# Altium project SmartWatch.PrjPcb (part 2 of 3)

## Sheet [2] MCU.SchDoc: BLE SoC
size A4; ApprovedBy: Muhammet YILDIZ; CheckedBy: Muhammet YILDIZ; Author: Muhammet YILDIZ; CompanyName: YıLDıZ IoT; DrawnBy: Muhammet YILDIZ; Engineer: Muhammet YILDIZ; Organization: YıLDıZ IoT; Address1: Elperek Mahallesi; Address2: Saray Sokak No:12; Address3: SAKARYA / TURKEY; Revision: 1; SheetNumber: 2; SheetTotal: 7; SheetSize: A4
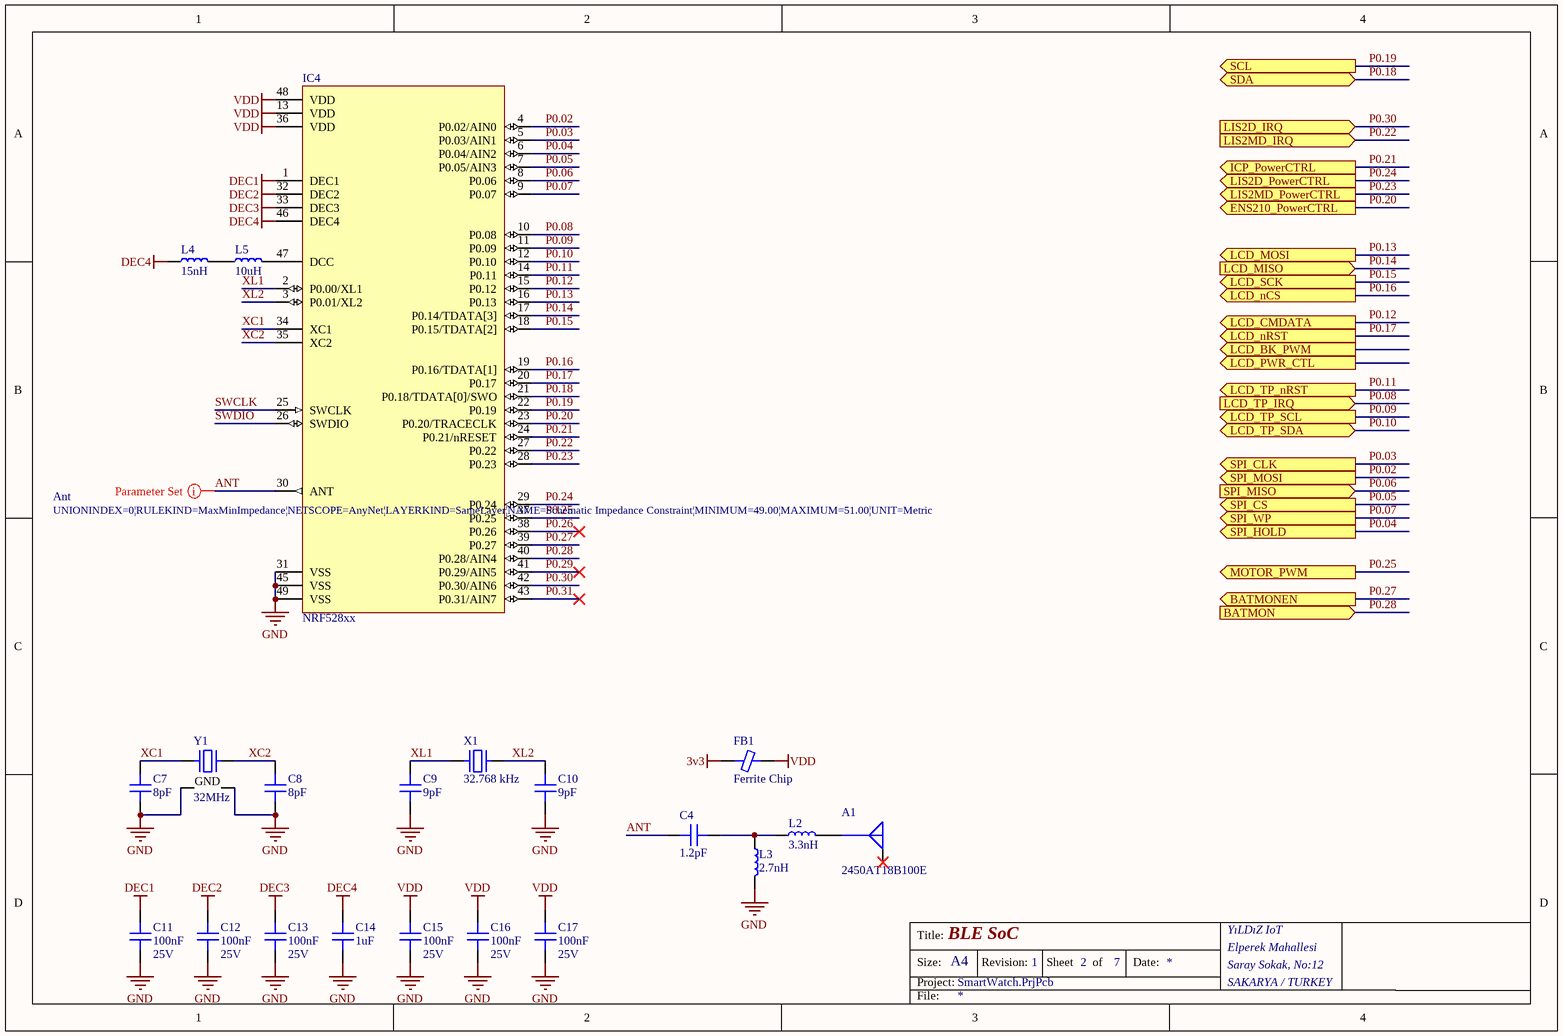
[diagram p2: [2] MCU.SchDoc]

### Parts
A1  2450AT18B100E  [ANTC3216X140N]
C4  1.2pF  [CAP 0402/1005]
C7  8pF  [CAP 0402/1005]
C8  8pF  [CAP 0402/1005]
C9  9pF  [CAP 0402/1005]
C10  9pF  [CAP 0402/1005]
C11  100nF  Voltage Rating (DC): 25V  [CAP 0402/1005]
C12  100nF  Voltage Rating (DC): 25V  [CAP 0402/1005]
C13  100nF  Voltage Rating (DC): 25V  [CAP 0402/1005]
C14  1uF  [CAP 0402/1005]
C15  100nF  Voltage Rating (DC): 25V  [CAP 0402/1005]
C16  100nF  Voltage Rating (DC): 25V  [CAP 0402/1005]
C17  100nF  Voltage Rating (DC): 25V  [CAP 0402/1005]
FB1  Ferrite Chip  [FER 0402/1005]  (no BOM)
IC4  NRF528xx  [QFN40P600X600X90-48N]
L2  3.3nH  [IND 0402/1005 RF WW]
L3  2.7nH  [IND 0402/1005 RF WW]
L4  15nH  [IND 0402/1005 RF WW]
L5  10uH  [IND 0603/1608 RF]
X1  32.768 kHz  [ABRACON ABS06]
Y1  32MHz  [KYOCERA CX2016DB]

### Ports
BATMON (in), BATMONEN (out), ENS210_PowerCTRL (out), ICP_PowerCTRL (out), LCD_BK_PWM (out), LCD_CMDATA (out), LCD_MISO (in), LCD_MOSI (out), LCD_nCS (out), LCD_nRST (out), LCD_PWR_CTL (out), LCD_SCK (out), LCD_TP_IRQ (in), LCD_TP_nRST (out), LCD_TP_SCL (out), LCD_TP_SDA (bidir), LIS2D_IRQ (in), LIS2D_PowerCTRL (out), LIS2MD_IRQ (in), LIS2MD_PowerCTRL (out), MOTOR_PWM (out), SCL (out), SDA (bidir), SPI_CLK (out), SPI_CS (out), SPI_HOLD (out), SPI_MISO (in), SPI_MOSI (out), SPI_WP (out)

### Nets
3v3: FB1.1
DEC1: C11.2 IC4.1(DEC1)
DEC2: C12.2 IC4.32(DEC2)
DEC3: C13.2 IC4.33(DEC3)
DEC4: C14.2 IC4.46(DEC4) L4.1
GND: C7.1 C8.1 C9.1 C10.1 C11.1 C12.1 C13.1 C14.1 C15.1 C16.1 C17.1 IC4.31(VSS) IC4.45(VSS) IC4.49(VSS) L3.2 Y1.2(GND) Y1.4(GND)
VDD: C15.2 C16.2 C17.2 FB1.2 IC4.13(VDD) IC4.36(VDD) IC4.48(VDD)
ANT: C4.2 IC4.30(ANT)
P0.02: IC4.4(P0.02/AIN0) ; port SPI_MOSI  [project net FLASH_MOSI]
P0.03: IC4.5(P0.03/AIN1) ; port SPI_CLK  [project net FLASH_CLK]
P0.04: IC4.6(P0.04/AIN2) ; port SPI_HOLD  [project net FLASH_HOLD]
P0.05: IC4.7(P0.05/AIN3) ; port SPI_CS  [project net FLASH_nCS]
P0.06: IC4.8(P0.06) ; port SPI_MISO  [project net FLASH_MISO]
P0.07: IC4.9(P0.07) ; port SPI_WP  [project net FLASH_WP]
P0.08: IC4.10(P0.08) ; port LCD_TP_IRQ  [project net LCD_TP_IRQ]
P0.09: IC4.11(P0.09) ; port LCD_TP_SCL  [project net LCD_TP_SCL]
P0.10: IC4.12(P0.10) ; port LCD_TP_SDA  [project net LCD_TP_SDA]
P0.11: IC4.14(P0.11) ; port LCD_TP_nRST  [project net LCD_TP_nRST]
P0.12: IC4.15(P0.12) ; port LCD_CMDATA  [project net CMD/DATA]
P0.13: IC4.16(P0.13) ; port LCD_MOSI  [project net LCD_MOSI]
P0.14: IC4.17(P0.14/TDATA[3]) ; port LCD_MISO  [project net LCD_MISO]
P0.15: IC4.18(P0.15/TDATA[2]) ; port LCD_SCK  [project net LCD_SCK]
P0.16: IC4.19(P0.16/TDATA[1]) ; port LCD_nCS  [project net LCD_nCS]
P0.17: IC4.20(P0.17) ; port LCD_nRST  [project net LCD_nRST]
P0.18: IC4.21(P0.18/TDATA[0]/SWO) ; port SDA
P0.19: IC4.22(P0.19) ; port SCL
P0.20: IC4.23(P0.20/TRACECLK) ; port ENS210_PowerCTRL  [project net ENS210_PowerCTRL]
P0.21: IC4.24(P0.21/nRESET) ; port ICP_PowerCTRL  [project net ICP_PowerCTRL]
P0.22: IC4.27(P0.22) ; port LIS2MD_IRQ  [project net LIS2MD_IRQ]
P0.23: IC4.28(P0.23) ; port LIS2MD_PowerCTRL  [project net LIS2MD_PowerCTRL]
P0.24: IC4.29(P0.24) ; port LIS2D_PowerCTRL  [project net LIS2D_PowerCTRL]
P0.25: IC4.37(P0.25) ; port MOTOR_PWM  [project net MOTOR_PWM]
P0.26: IC4.38(P0.26)
P0.27: IC4.39(P0.27) ; port BATMONEN  [project net BATMONEN]
P0.28: IC4.40(P0.28/AIN4) ; port BATMON  [project net BATMON]
P0.29: IC4.41(P0.29/AIN5)
P0.30: IC4.42(P0.30/AIN6) ; port LIS2D_IRQ  [project net LIS2D_IRQ]
P0.31: IC4.43(P0.31/AIN7)
SWCLK: IC4.25(SWCLK)
SWDIO: IC4.26(SWDIO)
XC1: C7.2 IC4.34(XC1) Y1.1
XC2: C8.2 IC4.35(XC2) Y1.3
XL1: C9.2 IC4.2(P0.00/XL1) X1.1
XL2: C10.2 IC4.3(P0.01/XL2) X1.2
NetA1_S: A1.S L2.2
NetC4_1: C4.1 L2.1 L3.1
NetIC4_47: IC4.47(DCC) L5.2
NetL4_2: L4.2 L5.1

Not connected (* = marked no-connect by the designer): A1 G*; IC4 44(NC)

### Layout directives
rule Impedance Constraint [Min = 49.00    Max = 51.00    ]; net class Ant: ANT

### Notes on the sheet
- Title:
- Size:
- Project:
- Revision:
- Sheet
- of
- Date:
- YıLDıZ IoT
- Elperek Mahallesi
- Saray Sokak, No:12
- SAKARYA / TURKEY
- File:

### Library data of the parts
A1 = Antenna: Antenna Chip -0.5dBi Gain 2500MHz 2-Pin CSMD T/R; Manufacturer: Johanson; Impedance: 50R; Bandwidth: 100MHz; Power Rating: 3W; Number of Bands: 1; Return Loss: -9.5dB; Frequency: 2.45GHz; Max Frequency: 2.5GHz; Gain: -0.5dB; Min Frequency: 2.4GHz; Supplier 1: Digi-Key; Supplier Part Number 1: 712-1006-1-ND; Manufacturer Part Number: 2450AT18B100E; RoHS: Yes; Category: RF Antennas; Stock 1: 432864; Pricing 1: 1=0,56000, 10=0,49500, 25=0,46480, 100=0,37950, 250=0,35248, 500=0,30000, 1000=0,24000 (USD); Mount: Surface Mount; Case/Package: CSMD; Contact Plating: Tin; Min Operating Temperature: -40°C; Max Operating Temperature: 85°C; Package Quantity: 1; Packaging: Tape and Reel; Max Power Dissipation: 3W; Termination: Solder; Series: -; Input Impedance: 50R; Input Power: 3W; Length: 3.2mm; Width: 1.6mm; Height: 0.051inch; Radiation Hardening: No; REACH SVHC: No SVHC; RoHS Compliant: Yes; ComponentLink1URL: https://datasheet.ciiva.com/24025/antenna-2450at18b100-242422-24025839.pdf?src-supplier=Mouser; ComponentLink1Description: https://datasheet.ciiva.com/24025/antenna-2450at18b100-242422-24025839.pdf?src-supplier=Mouser; ComponentLink2URL: https://datasheet.ciiva.com/1124/1318299-1124918.pdf?src-supplier=Element14; ComponentLink2Description: https://datasheet.ciiva.com/1124/1318299-1124918.pdf?src-supplier=Element14
C4 = Capacitor - Ceramic: Cap Ceramic 1.2pF 50V C0G 0.1pF SMD 0402 125C Paper T/R; Manufacturer: Johanson; Manufacturer Part Number: 500R07S1R2BV4T; Supplier 1: Digi-Key; Supplier Part Number 1: 712-1268-1-ND; RoHS: Yes; Category: Ceramic Capacitors; Stock 1: 1153; Pricing 1: 1=0,19000, 10=0,13000, 50=0,07820, 100=0,06600, 500=0,04518, 1000=0,03997, 2500=0,03824, 5000=0,03476 (USD); Case/Package: 0402; Number of Pins: 2; Dielectric Material: Ceramic; Contact Plating: Tin,Matte; Case Code (Imperial): 0402; Case Code (Metric): 1005; Min Operating Temperature: -55°C; Max Operating Temperature: 125°C; Packaging: Tape and Reel; Capacitance: 1.2pF; Dielectric: C0G; Voltage Rating (DC): 50V; Voltage Rating: 50V; Termination: SMD/SMT; Package Quantity: 10000; Series: S; Construction: Flat; Length: 1.02mm; Width: 0.02inch; Height: 0.64mm; Depth: 0.51mm; Thickness: 0.024inch; Radiation Hardening: No; REACH SVHC: Unknown; RoHS Compliant: Yes; ComponentLink1URL: https://datasheet.ciiva.com/1461/1731432-1461669.pdf?src-supplier=Element14; ComponentLink1Description: https://datasheet.ciiva.com/1461/1731432-1461669.pdf?src-supplier=Element14; ComponentLink2URL: https://datasheet.ciiva.com/22697/1731432-22697547.pdf?src-supplier=Element14; ComponentLink2Description: https://datasheet.ciiva.com/22697/1731432-22697547.pdf?src-supplier=Element14; ComponentLink3URL: https://datasheet.ciiva.com/28495/1932950-28495023.pdf?src-supplier=Element14; ComponentLink3Description: https://datasheet.ciiva.com/28495/1932950-28495023.pdf?src-supplier=Element14
C7 C8 = Capacitor - Ceramic: 0402 8 pF 50 V ±0.25 pF Tolerance C0G/NP0 Multilayer Ceramic Capacitor; Manufacturer: Murata; Manufacturer Part Number: GJM1555C1H8R0CB01D; Voltage Rating: 50V; Dielectric: C0G; Supplier 1: Digi-Key; Supplier Part Number 1: 490-3109-1-ND; RoHS: Yes; Category: Ceramic Capacitors; Stock 1: 170937; Pricing 1: 1=0,12000, 10=0,08500, 50=0,04620, 100=0,03770, 500=0,02696, 1000=0,02118, 2500=0,01925, 5000=0,01771 (USD); Mount: Surface Mount; Case/Package: 0402; Case Code (Metric): 1005; Case Code (Imperial): 0402; Min Operating Temperature: -55°C; Max Operating Temperature: 125°C; Capacitance: 8pF; Packaging: Tape and Reel; Package Quantity: 1; Voltage Rating (DC): 50V; Termination: SMD/SMT; Series: GJM; Construction: Flat; Length: 1mm; Width: 0.02inch; Height: 0.5mm; Thickness: 0.022inch; Depth: 0.5mm; Radiation Hardening: No; Lead Free: Lead Free; RoHS Compliant: Yes; ComponentLink1URL: https://datasheet.ciiva.com/2989/product-2989255.pdf?src-supplier=Avnet; ComponentLink1Description: https://datasheet.ciiva.com/2989/product-2989255.pdf?src-supplier=Avnet; ComponentLink2URL: https://datasheet.ciiva.com/165/partnumbering-e-01-165050.pdf?src-supplier=Digi-Key; ComponentLink2Description: https://datasheet.ciiva.com/165/partnumbering-e-01-165050.pdf?src-supplier=Digi-Key; ComponentLink3URL: https://datasheet.ciiva.com/29534/partnumbering-e-01-29534170.pdf?src-supplier=Digi-Key; ComponentLink3Description: https://datasheet.ciiva.com/29534/partnumbering-e-01-29534170.pdf?src-supplier=Digi-Key; ComponentLink4URL: https://datasheet.ciiva.com/29534/partnumbering-e-01-29534171.pdf?src-supplier=Digi-Key; ComponentLink4Description: https://datasheet.ciiva.com/29534/partnumbering-e-01-29534171.pdf?src-supplier=Digi-Key
C9 C10 = Capacitor - Ceramic: Cap Ceramic 9pF 50V C0G 0.25pF SMD 0402 125°C Paper T/R; Manufacturer: Samsung; Manufacturer Part Number: CL05C090CB5NNNC; Supplier 1: Digi-Key; Supplier Part Number 1: 1276-1616-1-ND; RoHS: Yes; Category: Ceramic Capacitors; Stock 1: 152596; Pricing 1: 1=0,10000, 10=0,04800, 50=0,02620, 100=0,02140, 500=0,01528, 1000=0,01201, 2500=0,01092, 5000=0,01004 (USD); Mount: Surface Mount; Case/Package: 0402; Case Code (Metric): 1005; Case Code (Imperial): 0402; Min Operating Temperature: -55°C; Max Operating Temperature: 125°C; Packaging: Tape and Reel; Package Quantity: 1; Capacitance: 9pF; Voltage Rating: 50V; Dielectric: C0G; Voltage Rating (DC): 50V; Series: CL; Construction: Flat; Length: 1mm; Width: 0.02inch; Height: 0.5mm; Thickness: 0.022inch; Depth: 0.5mm; Radiation Hardening: No; RoHS Compliant: Yes; ComponentLink1URL: https://datasheet.ciiva.com/25803/cl05c090cb5nnnc-25803844.pdf?src-supplier=Digi-Key; ComponentLink1Description: https://datasheet.ciiva.com/25803/cl05c090cb5nnnc-25803844.pdf?src-supplier=Digi-Key
C11-C13 C15-C17 = Capacitor - Ceramic: Cap Ceramic 0.1uF 25V X5R 10% Pad SMD 0402 85¡ãC T/R / Multi Layer Ceramic Capacitor (MLCC); Manufacturer: Samsung; Manufacturer Part Number: CL05A104KA5NNNC; Supplier 1: Digi-Key; Supplier Part Number 1: 1276-1043-6-ND; RoHS: Yes; Category: Ceramic Capacitors; Pricing 1: 1=0,10000, 10=0,01100, 50=0,00600, 100=0,00490, 500=0,00346, 1000=0,00272, 2500=0,00248, 5000=0,00228 (USD); Mount: Surface Mount; Case/Package: 0402; Case Code (Imperial): 0402; Case Code (Metric): 1005; Min Operating Temperature: -55°C; Max Operating Temperature: 85°C; Capacitance: 100nF; Packaging: Tape and Reel; Tolerance: 10%; Package Quantity: 1; Voltage Rating: 25V; Dielectric: X5R; Voltage: 25V; Length: 1mm; Width: 0.02inch; Height: 0.5mm; Thickness: 0.022inch; Depth: 0.5mm; Radiation Hardening: No; Lead Free: Lead Free; ComponentLink1URL: https://datasheet.ciiva.com/25802/cl05a104ka5nnnc-25802704.pdf?src-supplier=Digi-Key; ComponentLink1Description: https://datasheet.ciiva.com/25802/cl05a104ka5nnnc-25802704.pdf?src-supplier=Digi-Key; ComponentLink2URL: https://datasheet.ciiva.com/16437/cl05a104ka5nnnc-16437369.pdf?src-supplier=Future+Electronics; ComponentLink2Description: https://datasheet.ciiva.com/16437/cl05a104ka5nnnc-16437369.pdf?src-supplier=Future+Electronics; ComponentLink3URL: https://datasheet.ciiva.com/26838/getdatasheetpartid-357412-26838142.pdf?src-supplier=Verical; ComponentLink3Description: https://datasheet.ciiva.com/26838/getdatasheetpartid-357412-26838142.pdf?src-supplier=Verical; ComponentLink4URL: https://datasheet.ciiva.com/26309/mlcc-catalogdownload2013-eng-26309014.pdf?src-supplier=Distrelec; ComponentLink4Description: https://datasheet.ciiva.com/26309/mlcc-catalogdownload2013-eng-26309014.pdf?src-supplier=Distrelec
C14 = Capacitor - Ceramic: Ceramic capacitor SMD-0402 1000nF /16V X5R# K +-10%, Samsung, RoHS; Manufacturer Part Number: CL05A105KO5NNNC; Tolerance: 10%; Voltage Rating: 16V; Dielectric: X5R; Supplier 1: Digi-Key; Supplier Part Number 1: 1276-1067-1-ND; Manufacturer: Samsung; RoHS: Yes; Category: Ceramic Capacitors; Stock 1: 5192112; Pricing 1: 1=0,10000, 10=0,04400, 50=0,02400, 100=0,01960, 500=0,01402, 1000=0,01101, 2500=0,01001, 5000=0,00921 (USD); Mount: Surface Mount; Case/Package: 0402; Contact Plating: Tin; Case Code (Metric): 1005; Case Code (Imperial): 0402; Min Operating Temperature: -55°C; Max Operating Temperature: 85°C; Packaging: Tape and Reel; Package Quantity: 1; Series: CL; Capacitance: 1uF; Voltage: 16V; Construction: Flat; Length: 1mm; Width: 0.02inch; Height: 0.5mm; Thickness: 0.022inch; Depth: 0.5mm; Radiation Hardening: No; RoHS Compliant: Yes; ComponentLink1URL: https://datasheet.ciiva.com/16207/cl05a105ko5nnnc-16207571.pdf?src-supplier=Future+Electronics; ComponentLink1Description: https://datasheet.ciiva.com/16207/cl05a105ko5nnnc-16207571.pdf?src-supplier=Future+Electronics; ComponentLink2URL: https://datasheet.ciiva.com/15195/getdatasheetpartid-355272-15195629.pdf?src-supplier=Verical; ComponentLink2Description: https://datasheet.ciiva.com/15195/getdatasheetpartid-355272-15195629.pdf?src-supplier=Verical
FB1 = Ferrite Chip: SMT Ferrite Chip
IC4 = NRF528xx: Manufacturer: Nordic Semiconductor ASA; Manufacturer Part Number: NRF52832-QFAB-R; Satıcı: Digikey; RF Family/Standard: Bluetooth, General ISM > 1GHz; Frequency: 2.4GHz; Sensitivity: -96dBm; Power Output: 4dBm; Data Rate: 2Mbps; Current Receiving: 6,5mA; Voltage Supply: 1.7 - 3.6 V; Memory Size: 256kB Flash, 32kB RAM; Current Transmitting: 7,1mA; Protocol: ANT, Bluetooth v4.0; Serial Interfaces: I²C, SPI, UART; GPIO: 32; Depo Kodu: *; Package / Case: 48-VFQFN Exposed Pad; Satın Alma Linki: *; Datasheet: http://infocenter.nordicsemi.com/pdf/nRF52832_PS_v1.4.pdf; Suplier Code: *; Modulation: -; Operating Temperature: -40°C ~ 85°C; Mounting Type: Surface Mount; Type: TxRx + MCU; Value: NRF528xx
L2 = Inductor Air Core: Inductor RF Chip Multi-Layer 0.0033uH 0.3nH 100MHz 8Q-Factor Ceramic 0.3A 0.19Ohm DCR 0402 T/R; Manufacturer: Johanson; Manufacturer Part Number: L-07C3N3SV6T; Current Rating: 300mA; Shielding: Unshielded; Q Factor: 8; DC Resistance (DCR): 190mR; Self Resonant Frequency: 21GHz; Supplier 1: Digi-Key; Supplier Part Number 1: 712-1416-1-ND; RoHS: Yes; Category: Fixed Inductors; Stock 1: 842404; Pricing 1: 1=0,10000, 10=0,05000, 25=0,04480, 50=0,04000, 100=0,03390, 250=0,02992, 500=0,02744, 1000=0,02344, 2500=0,02095 (USD); Mount: Surface Mount; Case/Package: 0402; Number of Pins: 2; Case Code (Metric): 1005; Case Code (Imperial): 0402; Core Material: Ceramic; Weight: 2.3E-05oz; Min Operating Temperature: -40°C; Max Operating Temperature: 100°C; Packaging: Cut Tape; Package Quantity: 10000; Inductance: 3.3nH; Test Frequency: 100MHz; Max DC Current: 300mA; Termination: SMD/SMT; DC Current: 300mA; Series: L-07; Length: 1mm; Width: 0.5mm; Height: 0.5mm; Height - Seated (Max): 0.024inch; Depth: 0.6mm; Radiation Hardening: No; REACH SVHC: No SVHC; Military Standard: Not; RoHS Compliant: Yes; ComponentLink1URL: https://datasheet.ciiva.com/1473/1168792-1473902.pdf?src-supplier=Element14; ComponentLink1Description: https://datasheet.ciiva.com/1473/1168792-1473902.pdf?src-supplier=Element14
L3 = Inductor Air Core: Inductor RF Chip Multi-Layer 0.0027uH 0.3nH 100MHz 8Q-Factor Ceramic 0.3A 0.17Ohm DCR 0402 T/R; Manufacturer: Johanson; Manufacturer Part Number: L-07C2N7SV6T; Q Factor: 8; Current Rating: 300mA; Shielding: Unshielded; DC Resistance (DCR): 170mR; Self Resonant Frequency: 9.5GHz; Supplier 1: Digi-Key; Supplier Part Number 1: 712-1415-1-ND; RoHS: Yes; Category: Fixed Inductors; Stock 1: 895162; Pricing 1: 1=0,10000, 10=0,05000, 25=0,04480, 50=0,04000, 100=0,03390, 250=0,02992, 500=0,02744, 1000=0,02344, 2500=0,02095 (USD); Mount: Surface Mount; Case/Package: 0402; Number of Pins: 2; Case Code (Metric): 1005; Case Code (Imperial): 0402; Weight: 2.3E-05oz; Core Material: Ceramic; Contact Plating: Tin,Matte; Min Operating Temperature: -40°C; Max Operating Temperature: 100°C; Packaging: Tape and Reel; Package Quantity: 1; Inductance: 2.7nH; Test Frequency: 100MHz; Max DC Current: 300mA; Termination: SMD/SMT; DC Current: 300mA; Series: -; Length: 1mm; Width: 0.02inch; Height: 0.5mm; Height - Seated (Max): 0.024inch; Depth: 0.6mm; Radiation Hardening: No; REACH SVHC: No SVHC; Military Standard: Not; RoHS Compliant: Yes; ComponentLink1URL: https://datasheet.ciiva.com/1473/1168792-1473898.pdf?src-supplier=Element14; ComponentLink1Description: https://datasheet.ciiva.com/1473/1168792-1473898.pdf?src-supplier=Element14
L4 = Inductor Air Core: Ind High Frequency Chip Multi-Layer 15nH 5% 100MHz 8Q-Factor Ceramic 320mA 0402 T/R; Manufacturer: Taiyo Yuden; Manufacturer Part Number: HK100515NJ-T; Core Material: Ferrite,Ceramic; Shielding: Unshielded; Self Resonant Frequency: 2.3GHz; Q Factor: 8; DC Resistance (DCR): 460mR; Max DC Current: 300mA; Supplier 1: Avnet; Supplier Part Number 1: HK100515NJ-T; RoHS: Yes; Category: Fixed Inductors; Mount: Surface Mount; Case/Package: 0402; Number of Pins: 2; Case Code (Metric): 1005; Case Code (Imperial): 0402; Body Material: Ceramic; Min Operating Temperature: -55°C; Max Operating Temperature: 125°C; Packaging: Tape and Reel; Inductance: 15nH; Current Rating: 320mA; Package Quantity: 10000; Test Frequency: 100MHz; Termination: SMD/SMT; Tolerance: 5%; Series: HK; Inductance Tolerance: 5%; DC Current: 320mA; Length: 0.039inch; Width: 0.02inch; Height: 0.5mm; Height - Seated (Max): 0.022inch; Depth: 0.55mm; Radiation Hardening: No; RoHS Compliant: Yes; Lead Free: Exempt; Halogen Free: Halogen Free; REACH SVHC: Unknown; Military Standard: Not; ComponentLink1URL: https://datasheet.ciiva.com/6688/hk100515nj-t-ss-6688640.pdf?src-supplier=Digi-Key; ComponentLink1Description: https://datasheet.ciiva.com/6688/hk100515nj-t-ss-6688640.pdf?src-supplier=Digi-Key; ComponentLink2URL: https://datasheet.ciiva.com/8498/hk100515nj-t-ss-8498917.pdf?src-supplier=Avnet; ComponentLink2Description: https://datasheet.ciiva.com/8498/hk100515nj-t-ss-8498917.pdf?src-supplier=Avnet; ComponentLink3URL: https://datasheet.ciiva.com/26871/getdatasheetpartid-645793-26871605.pdf?src-supplier=Verical; ComponentLink3Description: https://datasheet.ciiva.com/26871/getdatasheetpartid-645793-26871605.pdf?src-supplier=Verical; ComponentLink4URL: https://datasheet.ciiva.com/15986/1443hk100515nj-t-15986294.pdf?src-supplier=Onlinecomponents.com; ComponentLink4Description: https://datasheet.ciiva.com/15986/1443hk100515nj-t-15986294.pdf?src-supplier=Onlinecomponents.com; ComponentLink5URL: https://datasheet.ciiva.com/30215/1387hk100515nj-t-30215366.pdf?src-supplier=Onlinecomponents.com; ComponentLink5Description: https://datasheet.ciiva.com/30215/1387hk100515nj-t-30215366.pdf?src-supplier=Onlinecomponents.com
L5 = Inductor Air Core: Inductor Chip Wirewound 10uH 10% 2.52MHz Ferrite 80mA 468mOhm DCR 0603 T/R; Manufacturer: Taiyo Yuden; Manufacturer Part Number: LBMF1608T100K; Self Resonant Frequency: 32MHz; Shielding: Unshielded; DC Resistance (DCR): 360mR; Supplier 1: Digi-Key; Supplier Part Number 1: 587-1714-1-ND; RoHS: Yes; Category: Fixed Inductors; Stock 1: 1662; Pricing 1: 1=0,25000, 10=0,22300, 25=0,19800, 50=0,16840, 100=0,14850, 250=0,13612, 500=0,12376, 1000=0,10395 (USD); Mount: Surface Mount; Case/Package: 0603; Core Material: Ferrite; Case Code (Metric): 1608; Case Code (Imperial): 0603; Weight: 7.1E-05oz; Min Operating Temperature: -40°C; Max Operating Temperature: 105°C; Packaging: Tape and Reel; Inductance: 10uH; Inductance Tolerance: 10%; Package Quantity: 3000; Tolerance: 10%; Current Rating: 80mA; Resistor Type: Wirewound; Test Frequency: 2.52MHz; Max DC Current: 80mA; Termination: SMD/SMT; DC Current: 80mA; Series: LB; Length: 0.063inch; Width: 0.031inch; Height: 0.35mm; Height - Seated (Max): 0.039inch; Lead Pitch: 0.7mm; Depth: 0.9mm; Radiation Hardening: No; Lead Free: Lead Free; Halogen Free: Halogen Free; REACH SVHC: Unknown; Military Standard: Not; RoHS Compliant: Yes; ComponentLink1URL: https://datasheet.ciiva.com/8504/lbmf1608t100k-ss-8504740.pdf?src-supplier=Avnet; ComponentLink1Description: https://datasheet.ciiva.com/8504/lbmf1608t100k-ss-8504740.pdf?src-supplier=Avnet; ComponentLink2URL: https://datasheet.ciiva.com/26872/getdatasheetpartid-637440-26872437.pdf?src-supplier=Verical; ComponentLink2Description: https://datasheet.ciiva.com/26872/getdatasheetpartid-637440-26872437.pdf?src-supplier=Verical; ComponentLink3URL: https://datasheet.ciiva.com/1040/lbmf1608t100k-ss-1040360.pdf?src-supplier=Digi-Key; ComponentLink3Description: https://datasheet.ciiva.com/1040/lbmf1608t100k-ss-1040360.pdf?src-supplier=Digi-Key; ComponentLink4URL: https://datasheet.ciiva.com/15986/610lbmf1608t100k-15986589.pdf?src-supplier=Onlinecomponents.com; ComponentLink4Description: https://datasheet.ciiva.com/15986/610lbmf1608t100k-15986589.pdf?src-supplier=Onlinecomponents.com; ComponentLink5URL: https://datasheet.ciiva.com/46395/1497259-46395174.pdf?src-supplier=Element14; ComponentLink5Description: https://datasheet.ciiva.com/46395/1497259-46395174.pdf?src-supplier=Element14
X1 = Abracon Crystal ABS06: Crystal 32.7680KHZ 9PF SMD; Manufacturer: Micro Crystal; Manufacturer Part Number: CM8V-T1A-32.768KHZ-9PF-20PPM-TA-QC; Supplier 1: Digi-Key; Supplier Part Number 1: 2195-CM8V-T1A-32.768KHZ-9PF-20PPM-TA-QCDKR-ND; RoHS: No; Stock 1: 55147; Pricing 1: 1=0,66000, 10=0,54700, 50=0,49260, 100=0,43780, 500=0,41592 (USD); Frequency: 32.768 kHz
Y1 = CX2016DB32000D0WZRC1: CRYSTAL 32.0000MHZ 8PF SMD; Manufacturer: Kyocera International Inc. Electronic Components; ESR (Equivalent Series Resistance): 60 Ohms; Frequency Stability: ±40ppm; Frequency Tolerance: ±25ppm; Operating Mode: Fundamental; Part Number: CX2016DB32000D0WZRC1; ComponentLink1Description: Datasheet; ComponentLink1URL: https://global.kyocera.com/prdct/electro/product/pdf/cx2016db_e.pdf; ComponentLink2Description: DigiKey Link; ComponentLink2URL: http://digikey.com/product-detail/en/kyocera-international-inc-electronic-components/CX2016DB32000D0WZRC1/1253-1586-1-ND/5436848; Frequency: 32MHz; Height - Seated (Max): 0.018" (0.45mm); LastUpdated: 02.09.2020 01:21:56; Lifecycle Status: Active; Load Capacitance: 8pF; Minimum Order: 1; Mounting Type: Surface Mount; Operating Temperature: -25°C ~ 75°C; Package / Case: 4-SMD, No Lead; Packaging: TapeAndReel; PartId: 466; Part Status: Active; Price: 0.36; Series: CX2016DB, Kyocera; Size / Dimension: 0.079" L x 0.063" W (2.00mm x 1.60mm); Supplier 1: DigiKey; Supplier Part Number 1: 1253-1586-1-ND; Type: MHz Crystal; Value: 32MHz

## Sheet [3] Sensor.SchDoc: Sensors
size A4; ApprovedBy: Muhammet YILDIZ; CheckedBy: Muhammet YILDIZ; Author: Muhammet YILDIZ; CompanyName: YıLDıZ IoT; DrawnBy: Muhammet YILDIZ; Engineer: Muhammet YILDIZ; Organization: YıLDıZ IoT; Address1: Elperek Mahallesi; Address2: Saray Sokak No:12; Address3: SAKARYA / TURKEY; Revision: 1; SheetNumber: 3; SheetTotal: 7; SheetSize: A4
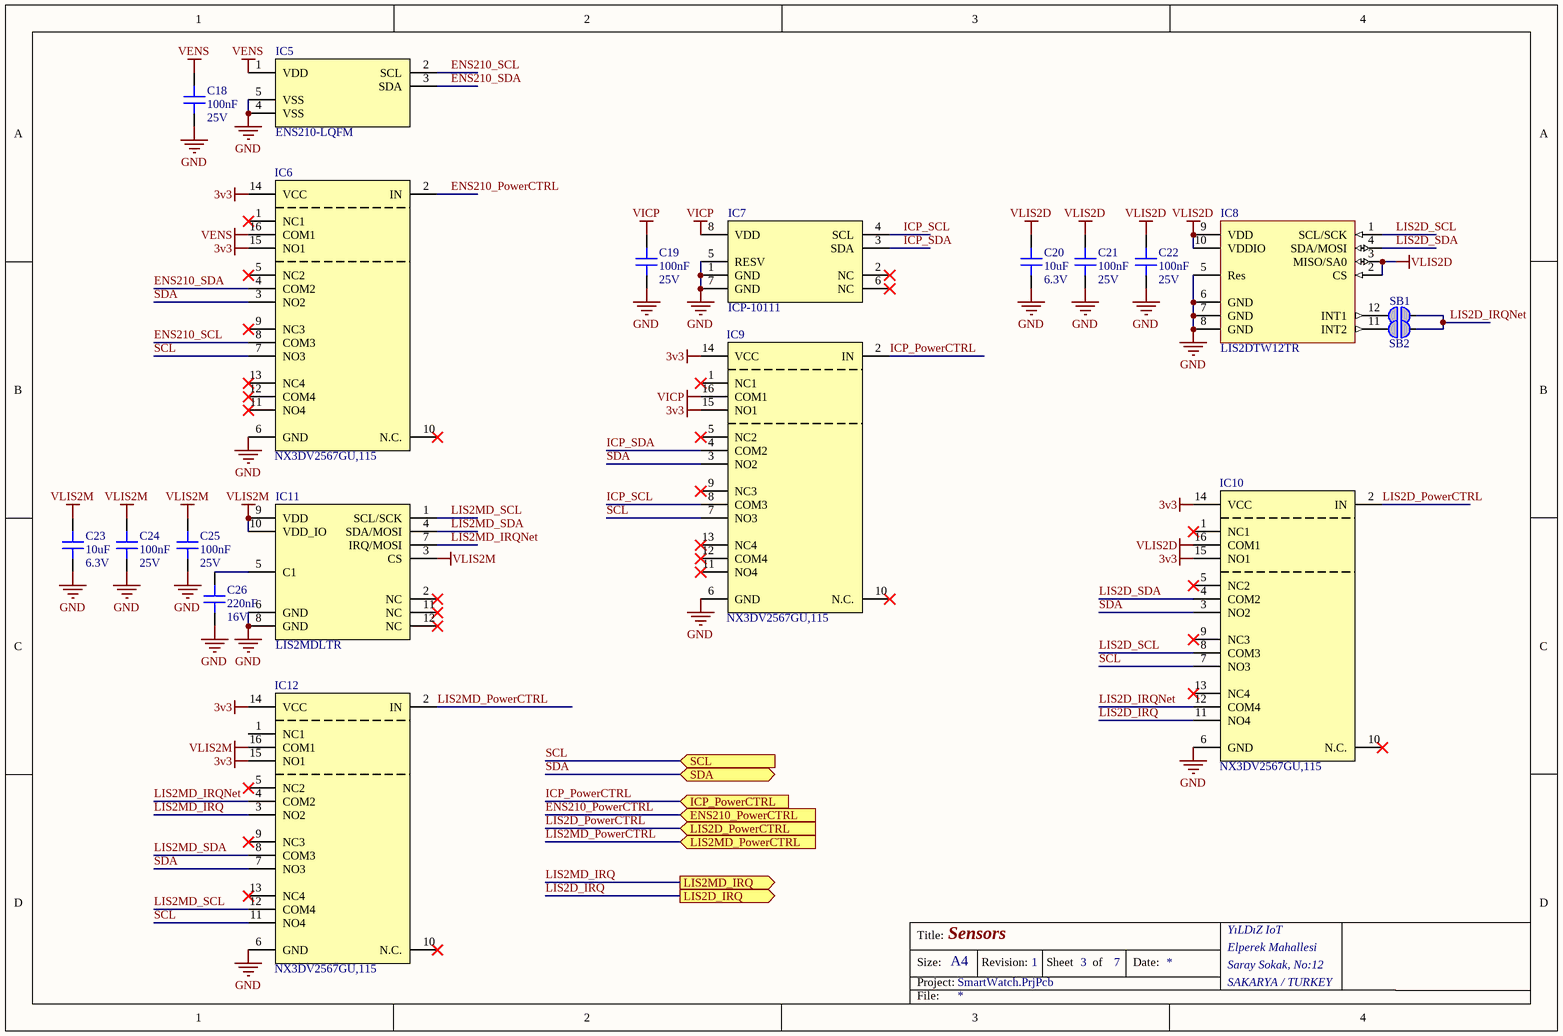
[diagram p3: [3] Sensor.SchDoc]

### Parts
C18  100nF  Voltage Rating (DC): 25V  [CAP 0402/1005]
C19  100nF  Voltage Rating (DC): 25V  [CAP 0402/1005]
C20  10uF  Voltage Rating: 6.3V  [CAP 0402/1005]
C21  100nF  Voltage Rating (DC): 25V  [CAP 0402/1005]
C22  100nF  Voltage Rating (DC): 25V  [CAP 0402/1005]
C23  10uF  Voltage Rating: 6.3V  [CAP 0402/1005]
C24  100nF  Voltage Rating (DC): 25V  [CAP 0402/1005]
C25  100nF  Voltage Rating (DC): 25V  [CAP 0402/1005]
C26  220nF  Voltage Rating: 16V  [CAP 0402/1005]
IC5  ENS210-LQFM  [SCIONSENSE ENS210LQFM]
IC6  NX3DV2567GU,115  [NXP XQFN16]
IC7  ICP-10111  [TDK ICP10111]
IC8  LIS2DTW12TR  [ST LGA-12 2x2x0.7]
IC9  NX3DV2567GU,115  [NXP XQFN16]
IC10  NX3DV2567GU,115  [NXP XQFN16]
IC11  LIS2MDLTR  [ST LGA-12 2x2x0.7]
IC12  NX3DV2567GU,115  [NXP XQFN16]
SB1  (no value)  [Solderbridge-Circular]  (no BOM)
SB2  (no value)  [Solderbridge-Circular]  (no BOM)

### Ports
ENS210_PowerCTRL (in), ICP_PowerCTRL (in), LIS2D_IRQ (out), LIS2D_PowerCTRL (in), LIS2MD_IRQ (out), LIS2MD_PowerCTRL (in), SCL (in), SDA (bidir)

### Nets
3v3: IC6.14(VCC) IC6.15(NO1) IC9.14(VCC) IC9.15(NO1) IC10.14(VCC) IC10.15(NO1) IC12.14(VCC) IC12.15(NO1)
GND: C18.1 C19.1 C20.1 C21.1 C22.1 C23.1 C24.1 C25.1 C26.1 IC5.4(VSS) IC5.5(VSS) IC6.6(GND) IC7.1(GND) IC7.5(RESV) IC7.7(GND) IC8.5(Res) IC8.6(GND) IC8.7(GND) IC8.8(GND) IC9.6(GND) IC10.6(GND) IC11.6(GND) IC11.8(GND) IC12.6(GND)
VENS: C18.2 IC5.1(VDD) IC6.16(COM1)
VICP: C19.2 IC7.8(VDD) IC9.16(COM1)
VLIS2D: C20.2 C21.2 C22.2 IC8.2(CS) IC8.3(MISO/SA0) IC8.9(VDD) IC8.10(VDDIO) IC10.16(COM1)
VLIS2M: C23.2 C24.2 C25.2 IC11.3(CS) IC11.9(VDD) IC11.10(VDD_IO) IC12.16(COM1)
ENS210_PowerCTRL: IC6.2(IN) ; port ENS210_PowerCTRL
ENS210_SCL: IC5.2(SCL) IC6.8(COM3)
ENS210_SDA: IC5.3(SDA) IC6.4(COM2)
ICP_PowerCTRL: IC9.2(IN) ; port ICP_PowerCTRL
ICP_SCL: IC7.4(SCL) IC9.8(COM3)
ICP_SDA: IC7.3(SDA) IC9.4(COM2)
LIS2D_IRQ: IC10.11(NO4) ; port LIS2D_IRQ
LIS2D_IRQNet: IC10.12(COM4) SB1.2 SB2.2
LIS2D_PowerCTRL: IC10.2(IN) ; port LIS2D_PowerCTRL
LIS2D_SCL: IC8.1(SCL/SCK) IC10.8(COM3)
LIS2D_SDA: IC8.4(SDA/MOSI) IC10.4(COM2)
LIS2MD_IRQ: IC12.3(NO2) ; port LIS2MD_IRQ
LIS2MD_IRQNet: IC11.7(IRQ/MOSI) IC12.4(COM2)
LIS2MD_PowerCTRL: IC12.2(IN) ; port LIS2MD_PowerCTRL
LIS2MD_SCL: IC11.1(SCL/SCK) IC12.12(COM4)
LIS2MD_SDA: IC11.4(SDA/MOSI) IC12.8(COM3)
SCL: IC6.7(NO3) IC9.7(NO3) IC10.7(NO3) IC12.11(NO4) ; port SCL  [project net P0.19]
SDA: IC6.3(NO2) IC9.3(NO2) IC10.3(NO2) IC12.7(NO3) ; port SDA  [project net P0.18]
NetC26_2: C26.2 IC11.5(C1)
NetIC8_11: IC8.11(INT2) SB2.1
NetIC8_12: IC8.12(INT1) SB1.1

Not connected (* = marked no-connect by the designer): IC6 1(NC1)* 5(NC2)* 9(NC3)* 10(N.C.)* 11(NO4)* 12(COM4)* 13(NC4)*; IC7 2(NC)* 6(NC)*; IC9 1(NC1)* 5(NC2)* 9(NC3)* 10(N.C.)* 11(NO4)* 12(COM4)* 13(NC4)*; IC10 1(NC1)* 5(NC2)* 9(NC3)* 10(N.C.)* 13(NC4)*; IC11 2(NC)* 11(NC)* 12(NC)*; IC12 1(NC1) 5(NC2)* 9(NC3)* 10(N.C.)* 13(NC4)*

### Notes on the sheet
- Title:
- Size:
- Project:
- Revision:
- Sheet
- of
- Date:
- YıLDıZ IoT
- Elperek Mahallesi
- Saray Sokak, No:12
- SAKARYA / TURKEY
- File:

### Library data of the parts
C18 C19 C21 C22 C24 C25 = Capacitor - Ceramic: as C11 on sheet [2] MCU; Supplier 1: Digi-Key; Supplier Part Number 1: 1276-1043-6-ND; RoHS: Yes; Category: Ceramic Capacitors; Pricing 1: 1=0,10000, 10=0,01100, 50=0,00600, 100=0,00490, 500=0,00346, 1000=0,00272, 2500=0,00248, 5000=0,00228 (USD); Mount: Surface Mount; Case/Package: 0402; Case Code (Imperial): 0402; Case Code (Metric): 1005; Min Operating Temperature: -55°C; Max Operating Temperature: 85°C; Capacitance: 100nF; Packaging: Tape and Reel; Tolerance: 10%; Package Quantity: 1; Voltage Rating: 25V; Dielectric: X5R; Voltage: 25V; Length: 1mm; Width: 0.02inch; Height: 0.5mm; Thickness: 0.022inch; Depth: 0.5mm; Radiation Hardening: No; Lead Free: Lead Free; ComponentLink1URL: https://datasheet.ciiva.com/25802/cl05a104ka5nnnc-25802704.pdf?src-supplier=Digi-Key; ComponentLink1Description: https://datasheet.ciiva.com/25802/cl05a104ka5nnnc-25802704.pdf?src-supplier=Digi-Key; ComponentLink2URL: https://datasheet.ciiva.com/16437/cl05a104ka5nnnc-16437369.pdf?src-supplier=Future+Electronics; ComponentLink2Description: https://datasheet.ciiva.com/16437/cl05a104ka5nnnc-16437369.pdf?src-supplier=Future+Electronics; ComponentLink3URL: https://datasheet.ciiva.com/26838/getdatasheetpartid-357412-26838142.pdf?src-supplier=Verical; ComponentLink3Description: https://datasheet.ciiva.com/26838/getdatasheetpartid-357412-26838142.pdf?src-supplier=Verical; ComponentLink4URL: https://datasheet.ciiva.com/26309/mlcc-catalogdownload2013-eng-26309014.pdf?src-supplier=Distrelec; ComponentLink4Description: https://datasheet.ciiva.com/26309/mlcc-catalogdownload2013-eng-26309014.pdf?src-supplier=Distrelec
C20 C23 = Capacitor - Ceramic: 0402 10 uF 6.3 V ±20 % Tolerance X5R Surface Mount Multilayer Ceramic Capacitor; Manufacturer: Murata; Manufacturer Part Number: GRM155R60J106ME15D; Tolerance: 20%; Supplier 1: Digi-Key; Supplier Part Number 1: 490-13238-1-ND; RoHS: Yes; Category: Ceramic Capacitors; Pricing 1: 1=0,18000, 10=0,12400, 50=0,07440, 100=0,06280, 500=0,04296, 1000=0,03800, 2500=0,03635, 5000=0,03304 (USD); Mount: Surface Mount; Case/Package: 0402; Case Code (Metric): 1005; Case Code (Imperial): 0402; Min Operating Temperature: -55°C; Max Operating Temperature: 85°C; Packaging: Tape and Reel; Capacitance: 10uF; Voltage Rating (DC): 6.3V; Dielectric: X5R; Length: 0.039inch; Width: 0.02inch; Thickness: 0.026inch; RoHS Compliant: Yes; ComponentLink1URL: https://www.murata.com/~/media/webrenewal/support/library/catalog/products/capacitor/mlcc/c02e.ashx?la=en-us&src-supplier=Digi-Key; ComponentLink1Description: https://www.murata.com/~/media/webrenewal/support/library/catalog/products/capacitor/mlcc/c02e.ashx?la=en-us&src-supplier=Digi-Key
C26 = Capacitor - Ceramic: Ceramic capacitor SMD-0402 220nF /16V X7R# K +-10%, Samsung, RoHS; Manufacturer Part Number: CL05B224KO5NNNC; Tolerance: 10%; Dielectric: X7R; Supplier 1: Digi-Key; Supplier Part Number 1: 1276-1176-1-ND; Manufacturer: Samsung; RoHS: Yes; Category: Ceramic Capacitors; Pricing 1: 1=0,10000, 10=0,03300, 50=0,01780, 100=0,01460, 500=0,01040, 1000=0,00817, 2500=0,00742, 5000=0,00683 (USD); Mount: Surface Mount; Case/Package: 0402; Case Code (Metric): 1005; Case Code (Imperial): 0402; Min Operating Temperature: -55°C; Max Operating Temperature: 125°C; Packaging: Tape and Reel; Capacitance: 220nF; Package Quantity: 1; Series: CL; Construction: Flat; Length: 1mm; Width: 0.02inch; Height: 0.5mm; Thickness: 0.022inch; Depth: 0.5mm; Radiation Hardening: No; RoHS Compliant: Yes; ComponentLink1URL: https://datasheet.ciiva.com/25800/cl05b224ko5nnnc-25800450.pdf?src-supplier=Digi-Key; ComponentLink1Description: https://datasheet.ciiva.com/25800/cl05b224ko5nnnc-25800450.pdf?src-supplier=Digi-Key; ComponentLink2URL: https://datasheet.ciiva.com/26838/getdatasheetpartid-358459-26838228.pdf?src-supplier=Verical; ComponentLink2Description: https://datasheet.ciiva.com/26838/getdatasheetpartid-358459-26838228.pdf?src-supplier=Verical; ComponentLink3URL: https://datasheet.ciiva.com/16428/cl05b224ko5nnnc-16428810.pdf?src-supplier=Future+Electronics; ComponentLink3Description: https://datasheet.ciiva.com/16428/cl05b224ko5nnnc-16428810.pdf?src-supplier=Future+Electronics
IC5 = SCIOSENSE ENS210-LQFM: ENS210 Series 3.6V 100%RH Relative Humidity & Temperature Sensor w/I²C Interface; Supplier 1: Digi-Key; Supplier Part Number 1: 2618-ENS210-LQFMCT-ND; Manufacturer: ScioSense; Manufacturer Part Number: ENS210-LQFM; Stock 1: 47662; Pricing 1: 1=2,87000, 5=2,66400, 10=2,21400, 25=1,84480, 50=1,64000, 100=1,55800, 500=1,31200, 1000=1,23000 (USD); ComponentLink1URL: https://datasheet.octopart.com/ENS210-LQFM-ScioSense-datasheet-149899868.pdf?src-supplier=Future+Electronics; ComponentLink1Description: https://datasheet.octopart.com/ENS210-LQFM-ScioSense-datasheet-149899868.pdf?src-supplier=Future+Electronics
IC6 IC9 IC10 IC12 = NXP NX3DV2567GU,115: NX3DV2567 Series 4.3 V 10.5 Ohm 4PDT Low-Ohmic Analog Switch - XQFN-16; Manufacturer: NXP Semiconductors; Number of Inputs: 4; Number of Outputs: 2; Number of Channels: 1; Min Supply Voltage: 1.4V; Max Supply Voltage: 4.3V; Max Power Dissipation: 250mW; On-State Resistance: 700mR; Operating Supply Current: 150nA; Turn-On Delay Time: 50ns; Turn-Off Delay Time: 30ns; Supply Type: Single; Supplier 1: Digi-Key; Supplier Part Number 1: 568-5206-1-ND; Manufacturer Part Number: NX3DV2567GU,115; RoHS: Yes; Category: Interface ICs; Stock 1: 5231; Pricing 1: 1=0,98000, 10=0,87300, 25=0,82880, 100=0,80340 (USD); Mount: Surface Mount; Number of Pins: 16; Min Operating Temperature: -40°C; Max Operating Temperature: 125°C; Package Quantity: 1; Packaging: Tape and Reel; Max Supply Current: 150nA; Power Dissipation: 250mW; Series: -; Radiation Hardening: No; Lead Free: Lead Free; RoHS Compliant: Yes; ComponentLink1URL: https://datasheet.ciiva.com/1667/nx3dv2567-1667296.pdf?src-supplier=Digi-Key; ComponentLink1Description: https://datasheet.ciiva.com/1667/nx3dv2567-1667296.pdf?src-supplier=Digi-Key; ComponentLink2URL: https://datasheet.ciiva.com/4917/nx3dv2567-42536-4917579.pdf?src-supplier=Mouser; ComponentLink2Description: https://datasheet.ciiva.com/4917/nx3dv2567-42536-4917579.pdf?src-supplier=Mouser; ComponentLink3URL: https://datasheet.ciiva.com/1667/nx3dv2567-1667295.pdf?src-supplier=Digi-Key; ComponentLink3Description: https://datasheet.ciiva.com/1667/nx3dv2567-1667295.pdf?src-supplier=Digi-Key; ComponentLink4URL: https://datasheet.ciiva.com/1667/nx3dv2567-1667294.pdf?src-supplier=Digi-Key; ComponentLink4Description: https://datasheet.ciiva.com/1667/nx3dv2567-1667294.pdf?src-supplier=Digi-Key; ComponentLink5URL: https://datasheet.ciiva.com/6638/nx3dv2567-6638700.pdf?src-supplier=Digi-Key; ComponentLink5Description: https://datasheet.ciiva.com/6638/nx3dv2567-6638700.pdf?src-supplier=Digi-Key
IC7 = TDK ICP-10111: Barometric Pressure/Temperature Sensor Digital 30kPa to 110kPa/-20 to 65°C 8-Pin LGA T/R; Manufacturer: TDK InvenSense; Output Type: I2C; Pressure Type: Differential; Operating Pressure: 15.95PSI; Port Style: No Port; Supplier 1: Digi-Key; Supplier Part Number 1: 1428-1145-1-ND; Manufacturer Part Number: ICP-10111; RoHS: No; Category: Pressure Sensors; Stock 1: 11029; Pricing 1: 1=4,26000, 5=3,76200, 10=3,32300, 25=2,69600, 50=2,38260, 100=2,31990, 500=1,94370, 1000=1,81830, 5000=1,69290 (USD); Case/Package: LGA; Number of Pins: 8; Min Operating Temperature: -40°C; Max Operating Temperature: 85°C; Termination: SMD/SMT; RoHS Compliant: No; ComponentLink1URL: https://product.tdk.com/info/en/documents/catalog_datasheet/capacitive-pressure/DS-000186-ICP-101xx-v1.1.pdf?src-supplier=Digi-Key; ComponentLink1Description: https://product.tdk.com/info/en/documents/catalog_datasheet/capacitive-pressure/DS-000186-ICP-101xx-v1.1.pdf?src-supplier=Digi-Key; ComponentLink2URL: https://product.tdk.com/info/en/documents/catalog_datasheet/capacitive-pressure/DS-000186-ICP-101xx-v1.0.pdf?src-supplier=Digi-Key; ComponentLink2Description: https://product.tdk.com/info/en/documents/catalog_datasheet/capacitive-pressure/DS-000186-ICP-101xx-v1.0.pdf?src-supplier=Digi-Key
IC8 = ST LIS2DE12TR: 3-axis MEMS Accelerometer and Temperature Sensor Digital Output 1.8V 12-Pin LGA T/R; Manufacturer: STMicroelectronics; Supplier 1: Digi-Key; Supplier Part Number 1: 497-19047-1-ND; Manufacturer Part Number: LIS2DTW12TR; RoHS: Yes; Category: Accelerometers; Stock 1: 8556; Pricing 1: 1=3,37000, 10=3,02400, 25=2,85880, 100=2,47750, 500=2,11750 (USD)
IC11 = ST LIS2MDLTR: LIS2MDL Series 3.6V 50 Hz High Performance 3-Axis Digital Magnetic Sensor-LGA-12; Manufacturer: STMicroelectronics; Output Type: SPI,I2C; Sensing Method: Magnetoresistive; Axis: X, Y, Z; Resolution: 16b; Bandwidth: 50Hz; Supplier 1: Digi-Key; Supplier Part Number 1: 497-17588-1-ND; Manufacturer Part Number: LIS2MDLTR; RoHS: Yes; Category: Inertial Measurement Units (IMUs); Stock 1: 4476; Pricing 1: 1=3,07000, 10=2,75500, 25=2,59880, 100=2,21410, 500=1,81912, 1000=1,73250 (USD); Case/Package: LGA; Number of Pins: 12; Min Operating Temperature: -40°C; Max Operating Temperature: 85°C; Packaging: Tape and Reel; RoHS Compliant: Yes; ComponentLink1URL: http://www.farnell.com/datasheets/2815952.pdf?src-supplier=Farnell; ComponentLink1Description: http://www.farnell.com/datasheets/2815952.pdf?src-supplier=Farnell; ComponentLink2URL: http://www.farnell.com/datasheets/2815952.pdf?src-supplier=Newark; ComponentLink2Description: http://www.farnell.com/datasheets/2815952.pdf?src-supplier=Newark; ComponentLink3URL: http://www.st.com/content/ccc/resource/technical/document/datasheet/group3/29/13/d1/e0/9a/4d/4f/30/DM00395193/files/DM00395193.pdf/jcr:content/translations/en.DM00395193.pdf?src-supplier=Digi-Key; ComponentLink3Description: http://www.st.com/content/ccc/resource/technical/document/datasheet/group3/29/13/d1/e0/9a/4d/4f/30/DM00395193/files/DM00395193.pdf/jcr:content/translations/en.DM00395193.pdf?src-supplier=Digi-Key
SB1 SB2 = SOLDERBRIDGE

## Sheet [4] TFT LCD.SchDoc: TFT LCD
size A4; ApprovedBy: Muhammet YILDIZ; CheckedBy: Muhammet YILDIZ; Author: Muhammet YILDIZ; CompanyName: YıLDıZ IoT; DrawnBy: Muhammet YILDIZ; Engineer: Muhammet YILDIZ; Organization: YıLDıZ IoT; Address1: Elperek Mahallesi; Address2: Saray Sokak No:12; Address3: SAKARYA / TURKEY; Revision: 1; SheetNumber: 4; SheetTotal: 7; SheetSize: A4
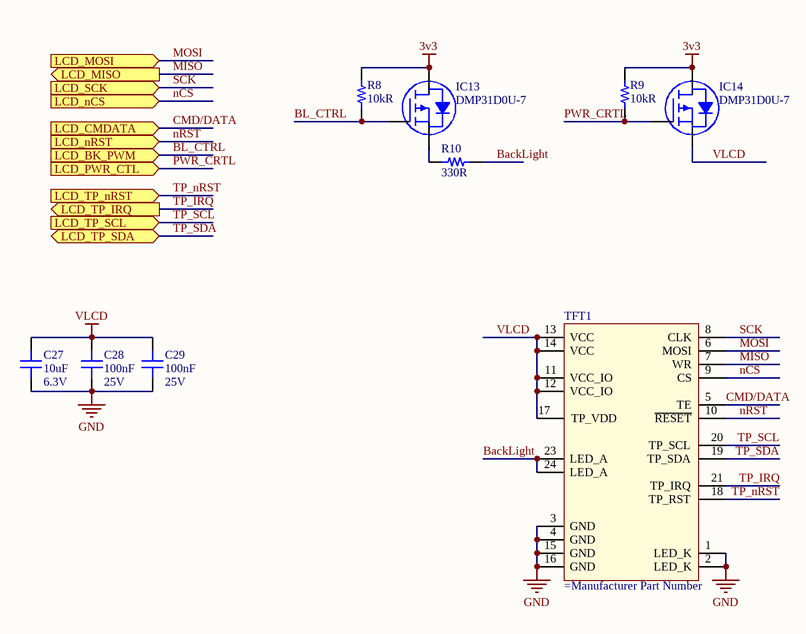
[diagram p4: [4] TFT LCD.SchDoc]

### Parts
C27  10uF  Voltage Rating: 6.3V  [CAP 0402/1005]
C28  100nF  Voltage Rating (DC): 25V  [CAP 0402/1005]
C29  100nF  Voltage Rating (DC): 25V  [CAP 0402/1005]
IC13  DMP31D0U-7  [DIODES SOT-23-3]
IC14  DMP31D0U-7  [DIODES SOT-23-3]
R8  10kR  [RES 0402/1005]
R9  10kR  [RES 0402/1005]
R10  330R  [RES 0402/1005]
TFT1  (no value)  [EASTRISE ER-TFT1.28-2]

### Ports
LCD_BK_PWM (in), LCD_CMDATA (in), LCD_MISO (out), LCD_MOSI (in), LCD_nCS (in), LCD_nRST (in), LCD_PWR_CTL (in), LCD_SCK (in), LCD_TP_IRQ (out), LCD_TP_nRST (in), LCD_TP_SCL (in), LCD_TP_SDA (bidir)

### Nets
3v3: IC13.3(D) IC14.3(D) R8.2 R9.2
GND: C27.1 C28.1 C29.1 TFT1.1(LED_K) TFT1.2(LED_K) TFT1.3(GND) TFT1.4(GND) TFT1.15(GND) TFT1.16(GND)
VLCD: C27.2 C28.2 C29.2 IC14.2(S) TFT1.11(VCC_IO) TFT1.12(VCC_IO) TFT1.13(VCC) TFT1.14(VCC) TFT1.17(TP_VDD)
BackLight: R10.2 TFT1.23(LED_A) TFT1.24(LED_A)
BL_CTRL: IC13.1(G) R8.1 ; port LCD_BK_PWM
CMD/DATA: TFT1.5(TE) ; port LCD_CMDATA
MISO: TFT1.7(WR) ; port LCD_MISO  [project net LCD_MISO]
MOSI: TFT1.6(MOSI) ; port LCD_MOSI  [project net LCD_MOSI]
nCS: TFT1.9(CS) ; port LCD_nCS  [project net LCD_nCS]
nRST: TFT1.10(~{RESET}) ; port LCD_nRST  [project net LCD_nRST]
PWR_CRTL: IC14.1(G) R9.1 ; port LCD_PWR_CTL  [project net LCD_PWR_CTL]
SCK: TFT1.8(CLK) ; port LCD_SCK  [project net LCD_SCK]
TP_IRQ: TFT1.21(TP_IRQ) ; port LCD_TP_IRQ  [project net LCD_TP_IRQ]
TP_nRST: TFT1.18(TP_RST) ; port LCD_TP_nRST  [project net LCD_TP_nRST]
TP_SCL: TFT1.20(TP_SCL) ; port LCD_TP_SCL  [project net LCD_TP_SCL]
TP_SDA: TFT1.19(TP_SDA) ; port LCD_TP_SDA  [project net LCD_TP_SDA]
NetIC13_2: IC13.2(S) R10.1

### Notes on the sheet
- Title:
- Size:
- Project:
- Revision:
- Sheet
- of
- Date:
- YıLDıZ IoT
- Elperek Mahallesi
- Saray Sokak, No:12
- SAKARYA / TURKEY
- File:

### Library data of the parts
C27 = Capacitor - Ceramic: as C20 on sheet [3] Sensor; Supplier 1: Digi-Key; Supplier Part Number 1: 490-13238-1-ND; RoHS: Yes; Category: Ceramic Capacitors; Pricing 1: 1=0,18000, 10=0,12400, 50=0,07440, 100=0,06280, 500=0,04296, 1000=0,03800, 2500=0,03635, 5000=0,03304 (USD); Mount: Surface Mount; Case/Package: 0402; Case Code (Metric): 1005; Case Code (Imperial): 0402; Min Operating Temperature: -55°C; Max Operating Temperature: 85°C; Packaging: Tape and Reel; Capacitance: 10uF; Voltage Rating (DC): 6.3V; Dielectric: X5R; Length: 0.039inch; Width: 0.02inch; Thickness: 0.026inch; RoHS Compliant: Yes; ComponentLink1URL: https://www.murata.com/~/media/webrenewal/support/library/catalog/products/capacitor/mlcc/c02e.ashx?la=en-us&src-supplier=Digi-Key; ComponentLink1Description: https://www.murata.com/~/media/webrenewal/support/library/catalog/products/capacitor/mlcc/c02e.ashx?la=en-us&src-supplier=Digi-Key
C28 C29 = Capacitor - Ceramic: as C11 on sheet [2] MCU; Supplier 1: Digi-Key; Supplier Part Number 1: 1276-1043-6-ND; RoHS: Yes; Category: Ceramic Capacitors; Pricing 1: 1=0,10000, 10=0,01100, 50=0,00600, 100=0,00490, 500=0,00346, 1000=0,00272, 2500=0,00248, 5000=0,00228 (USD); Mount: Surface Mount; Case/Package: 0402; Case Code (Imperial): 0402; Case Code (Metric): 1005; Min Operating Temperature: -55°C; Max Operating Temperature: 85°C; Capacitance: 100nF; Packaging: Tape and Reel; Tolerance: 10%; Package Quantity: 1; Voltage Rating: 25V; Dielectric: X5R; Voltage: 25V; Length: 1mm; Width: 0.02inch; Height: 0.5mm; Thickness: 0.022inch; Depth: 0.5mm; Radiation Hardening: No; Lead Free: Lead Free; ComponentLink1URL: https://datasheet.ciiva.com/25802/cl05a104ka5nnnc-25802704.pdf?src-supplier=Digi-Key; ComponentLink1Description: https://datasheet.ciiva.com/25802/cl05a104ka5nnnc-25802704.pdf?src-supplier=Digi-Key; ComponentLink2URL: https://datasheet.ciiva.com/16437/cl05a104ka5nnnc-16437369.pdf?src-supplier=Future+Electronics; ComponentLink2Description: https://datasheet.ciiva.com/16437/cl05a104ka5nnnc-16437369.pdf?src-supplier=Future+Electronics; ComponentLink3URL: https://datasheet.ciiva.com/26838/getdatasheetpartid-357412-26838142.pdf?src-supplier=Verical; ComponentLink3Description: https://datasheet.ciiva.com/26838/getdatasheetpartid-357412-26838142.pdf?src-supplier=Verical; ComponentLink4URL: https://datasheet.ciiva.com/26309/mlcc-catalogdownload2013-eng-26309014.pdf?src-supplier=Distrelec; ComponentLink4Description: https://datasheet.ciiva.com/26309/mlcc-catalogdownload2013-eng-26309014.pdf?src-supplier=Distrelec
IC13 IC14 = DMP31D0U-7: MOSFET P-CH 30V 530MA SOT23; Manufacturer: Diodes Incorporated; Current - Continuous Drain (Id) @ 25°C: 530mA (Ta); Drive Voltage (Max Rds On,  Min Rds On): 1.8V, 4.5V; FET Type: P-Channel; Gate Charge (Qg) (Max) @ Vgs: 0.9nC @ 4.5V; Input Capacitance (Ciss) (Max) @ Vds: 76pF @ 15V; Power Dissipation (Max): 450mW (Ta); Rds On (Max) @ Id, Vgs: 1Ohm @ 400mA, 4.5V; Vgs (Max): ±8V; Vgs(th) (Max) @ Id: 1.1V @ 250µA; Part Number: DMP31D0U-7; ComponentLink1Description: Datasheet; ComponentLink1URL: https://www.diodes.com/assets/Datasheets/DMP31D0U.pdf; ComponentLink2Description: DigiKey Link; ComponentLink2URL: http://digikey.com/product-detail/en/diodes-incorporated/DMP31D0U-7/DMP31D0U-7DICT-ND/4457888; Drain to Source Voltage (Vdss): 30V; LastUpdated: 02.09.2020 01:25:04; Lifecycle Status: Active; Minimum Order: 1; Mounting Type: Surface Mount; Operating Temperature: -55°C ~ 150°C (TJ); Package / Case: TO-236-3, SC-59, SOT-23-3; Packaging: TapeAndReel; Part Status: Active; Price: 0.09; Series: -; Supplier 1: DigiKey; Supplier Part Number 1: DMP31D0U-7DICT-ND; Supplier Device Package: SOT-23; Technology: MOSFET (Metal Oxide)
R8 R9 = Resistor_Chip: Res Thick Film 0402 10K Ohm 1% 0.063W(1/16W) ±100ppm/C Pad SMD Automotive T/R; Manufacturer: Stackpole Electronics; Manufacturer Part Number: RMCF0402FT10K0; Power Rating: 62.5mW; Temperature Coefficient: 100ppm/°C; Max Power Dissipation: 63mW; Supplier 1: Digi-Key; Supplier Part Number 1: RMCF0402FT10K0DKR-ND; RoHS: Yes; Category: Chip SMD Resistors; Pricing 1: 1=0,10000, 10=0,01500, 100=0,00610, 1000=0,00274, 2500=0,00238, 5000=0,00197 (USD); Mount: Surface Mount; Case/Package: 0402; Case Code (Metric): 1005; Case Code (Imperial): 0402; Contact Plating: Tin,Matte; Size Code: 0402; Min Operating Temperature: -55°C; Max Operating Temperature: 155°C; Tolerance: 1%; Packaging: Tape and Reel; Resistance: 10kR; Resistor Type: Thick Film; Number of Terminations: 2; Features: Automotive AEC-Q200; Series: RMCF; Construction: Rectangular; Length: 1mm; Width: 0.02inch; Height: 0.016inch; Depth: 0.5mm; Radiation Hardening: No; Military Standard: Not; Lead Free: Lead Free; RoHS Compliant: Yes; ComponentLink1URL: https://datasheet.ciiva.com/24341/sei-rmcp-24341800.pdf?src-supplier=Onlinecomponents.com; ComponentLink1Description: https://datasheet.ciiva.com/24341/sei-rmcp-24341800.pdf?src-supplier=Onlinecomponents.com
R10 = Resistor_Chip: Res Thick Film 0402 330 Ohm 1% 0.063W(1/16W) ±100ppm/C Pad SMD T/R; Manufacturer: Walsin Technologies; Manufacturer Part Number: WR04X3300FTL; Voltage Rating: 50V; Power Rating: 62.5mW; Temperature Coefficient: 100ppm/°C; Supplier 1: Digi-Key; Supplier Part Number 1: 1292-WR04X3300FTLCT-ND; RoHS: Yes; Category: Chip SMD Resistors; Stock 1: 3930; Pricing 1: 1=0,10000, 10=0,01000, 100=0,00360, 1000=0,00162, 2500=0,00140, 5000=0,00116 (USD); Case/Package: Molded; Case Code (Metric): 1005; Case Code (Imperial): 0402; Contact Material: Tin; Min Operating Temperature: -55°C; Max Operating Temperature: 155°C; Packaging: Tape and Reel; Resistance: 330R; Tolerance: 1%; Resistor Type: Thick Film,Metal Oxide; Voltage Rating (DC): 50V; Length: 1mm; Depth: 0.5mm; REACH SVHC: Unknown; Military Standard: Not; Lead Free: Lead Free; RoHS Compliant: Yes; ComponentLink1URL: http://www.farnell.com/datasheets/1960319.pdf?src-supplier=Farnell; ComponentLink1Description: http://www.farnell.com/datasheets/1960319.pdf?src-supplier=Farnell; ComponentLink2URL: https://www.verical.com/server-webapp/html/getDatasheet?partID=413958&src-supplier=Verical; ComponentLink2Description: https://www.verical.com/server-webapp/html/getDatasheet?partID=413958&src-supplier=Verical; ComponentLink3URL: http://components.arrow.com/part/dataview/0323_00666659?src-supplier=Arrow+Europe; ComponentLink3Description: http://components.arrow.com/part/dataview/0323_00666659?src-supplier=Arrow+Europe; ComponentLink4URL: http://www.farnell.com/datasheets/1960319.pdf?src-supplier=Element14; ComponentLink4Description: http://www.farnell.com/datasheets/1960319.pdf?src-supplier=Element14
TFT1 = EASTRISE ER-TFT1.28-2: ER-TFT1.28-2 TFT LCD Display Datasheet

## Sheet [5] Flash.SchDoc: Serial Flash
size A4; ApprovedBy: Muhammet YILDIZ; CheckedBy: Muhammet YILDIZ; Author: Muhammet YILDIZ; CompanyName: YıLDıZ IoT; DrawnBy: Muhammet YILDIZ; Engineer: Muhammet YILDIZ; Organization: YıLDıZ IoT; Address1: Elperek Mahallesi; Address2: Saray Sokak No:12; Address3: SAKARYA / TURKEY; Revision: 1; SheetNumber: 5; SheetTotal: 7; SheetSize: A4
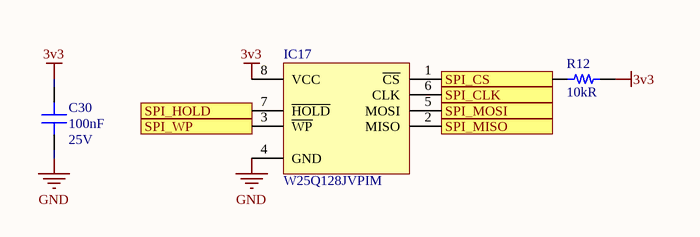
[diagram p5: [5] Flash.SchDoc]

### Parts
C30  100nF  Voltage Rating (DC): 25V  [CAP 0402/1005]
IC17  W25Q128JVPIM  [WINBOND WSON-8 6x5mm]
R12  10kR  [RES 0402/1005]

### Ports
SPI_CLK (in), SPI_CS (in), SPI_HOLD (in), SPI_MISO (out), SPI_MOSI (in), SPI_WP (in)

### Nets
3v3: C30.2 IC17.8(VCC) R12.2
GND: C30.1 IC17.4(GND)
FLASH_CLK: IC17.6(CLK) ; port SPI_CLK
FLASH_HOLD: IC17.7(~{HOLD}) ; port SPI_HOLD
FLASH_MISO: IC17.2(MISO) ; port SPI_MISO
FLASH_MOSI: IC17.5(MOSI) ; port SPI_MOSI
FLASH_nCS: IC17.1(~{CS}) R12.1 ; port SPI_CS
FLASH_WP: IC17.3(~{WP}) ; port SPI_WP

### Notes on the sheet
- Title:
- Size:
- Project:
- Revision:
- Sheet
- of
- Date:
- YıLDıZ IoT
- Elperek Mahallesi
- Saray Sokak, No:12
- SAKARYA / TURKEY
- File:

### Library data of the parts
C30 = Capacitor - Ceramic: as C11 on sheet [2] MCU; Supplier 1: Digi-Key; Supplier Part Number 1: 1276-1043-6-ND; RoHS: Yes; Category: Ceramic Capacitors; Pricing 1: 1=0,10000, 10=0,01100, 50=0,00600, 100=0,00490, 500=0,00346, 1000=0,00272, 2500=0,00248, 5000=0,00228 (USD); Mount: Surface Mount; Case/Package: 0402; Case Code (Imperial): 0402; Case Code (Metric): 1005; Min Operating Temperature: -55°C; Max Operating Temperature: 85°C; Capacitance: 100nF; Packaging: Tape and Reel; Tolerance: 10%; Package Quantity: 1; Voltage Rating: 25V; Dielectric: X5R; Voltage: 25V; Length: 1mm; Width: 0.02inch; Height: 0.5mm; Thickness: 0.022inch; Depth: 0.5mm; Radiation Hardening: No; Lead Free: Lead Free; ComponentLink1URL: https://datasheet.ciiva.com/25802/cl05a104ka5nnnc-25802704.pdf?src-supplier=Digi-Key; ComponentLink1Description: https://datasheet.ciiva.com/25802/cl05a104ka5nnnc-25802704.pdf?src-supplier=Digi-Key; ComponentLink2URL: https://datasheet.ciiva.com/16437/cl05a104ka5nnnc-16437369.pdf?src-supplier=Future+Electronics; ComponentLink2Description: https://datasheet.ciiva.com/16437/cl05a104ka5nnnc-16437369.pdf?src-supplier=Future+Electronics; ComponentLink3URL: https://datasheet.ciiva.com/26838/getdatasheetpartid-357412-26838142.pdf?src-supplier=Verical; ComponentLink3Description: https://datasheet.ciiva.com/26838/getdatasheetpartid-357412-26838142.pdf?src-supplier=Verical; ComponentLink4URL: https://datasheet.ciiva.com/26309/mlcc-catalogdownload2013-eng-26309014.pdf?src-supplier=Distrelec; ComponentLink4Description: https://datasheet.ciiva.com/26309/mlcc-catalogdownload2013-eng-26309014.pdf?src-supplier=Distrelec
IC17 = WINBOND FLASH SPI 8PIN: NOR Flash Serial (SPI, Dual SPI, Quad SPI) 3V/3.3V 128M-bit 16M x 8 6ns 8-Pin WSON EP T/R/Tray/Tube; Supplier 1: Digi-Key; Supplier Part Number 1: W25Q128JVPIM-ND; Manufacturer: Winbond; Manufacturer Part Number: W25Q128JVPIM; RoHS: Yes; Category: Memory; Stock 1: 40934; Pricing 1: 1=1.97000, 10=1.79800, 25=1.74960, 50=1.74080, 100=1.55600, 250=1.55152, 500=1.52810, 1000=1.46322, 5000=1.36231 (USD); RoHS Compliant: Yes; ComponentLink1URL: http://www.winbond.com/resource-files/w25q128jv_dtr%20revc%2003272018%20plus.pdf?src-supplier=Digi-Key; ComponentLink1Description: http://www.winbond.com/resource-files/w25q128jv_dtr%20revc%2003272018%20plus.pdf?src-supplier=Digi-Key
R12 = Resistor_Chip: as R8 on sheet [4] TFT LCD; Supplier 1: Digi-Key; Supplier Part Number 1: RMCF0402FT10K0CT-ND; RoHS: Yes; Category: Chip SMD Resistors; Pricing 1: 1=0,10000, 10=0,01500, 100=0,00610, 1000=0,00274, 2500=0,00238, 5000=0,00197 (USD); Mount: Surface Mount; Case/Package: 0402; Case Code (Metric): 1005; Case Code (Imperial): 0402; Contact Plating: Tin,Matte; Size Code: 0402; Min Operating Temperature: -55°C; Max Operating Temperature: 155°C; Tolerance: 1%; Packaging: Tape and Reel; Resistance: 10kR; Resistor Type: Thick Film; Number of Terminations: 2; Features: Automotive AEC-Q200; Series: RMCF; Construction: Rectangular; Length: 1mm; Width: 0.02inch; Height: 0.016inch; Depth: 0.5mm; Radiation Hardening: No; Military Standard: Not; Lead Free: Lead Free; RoHS Compliant: Yes; ComponentLink1URL: https://datasheet.ciiva.com/24341/sei-rmcp-24341800.pdf?src-supplier=Onlinecomponents.com; ComponentLink1Description: https://datasheet.ciiva.com/24341/sei-rmcp-24341800.pdf?src-supplier=Onlinecomponents.com